# Altium project SMARTCAR.PRJPCB
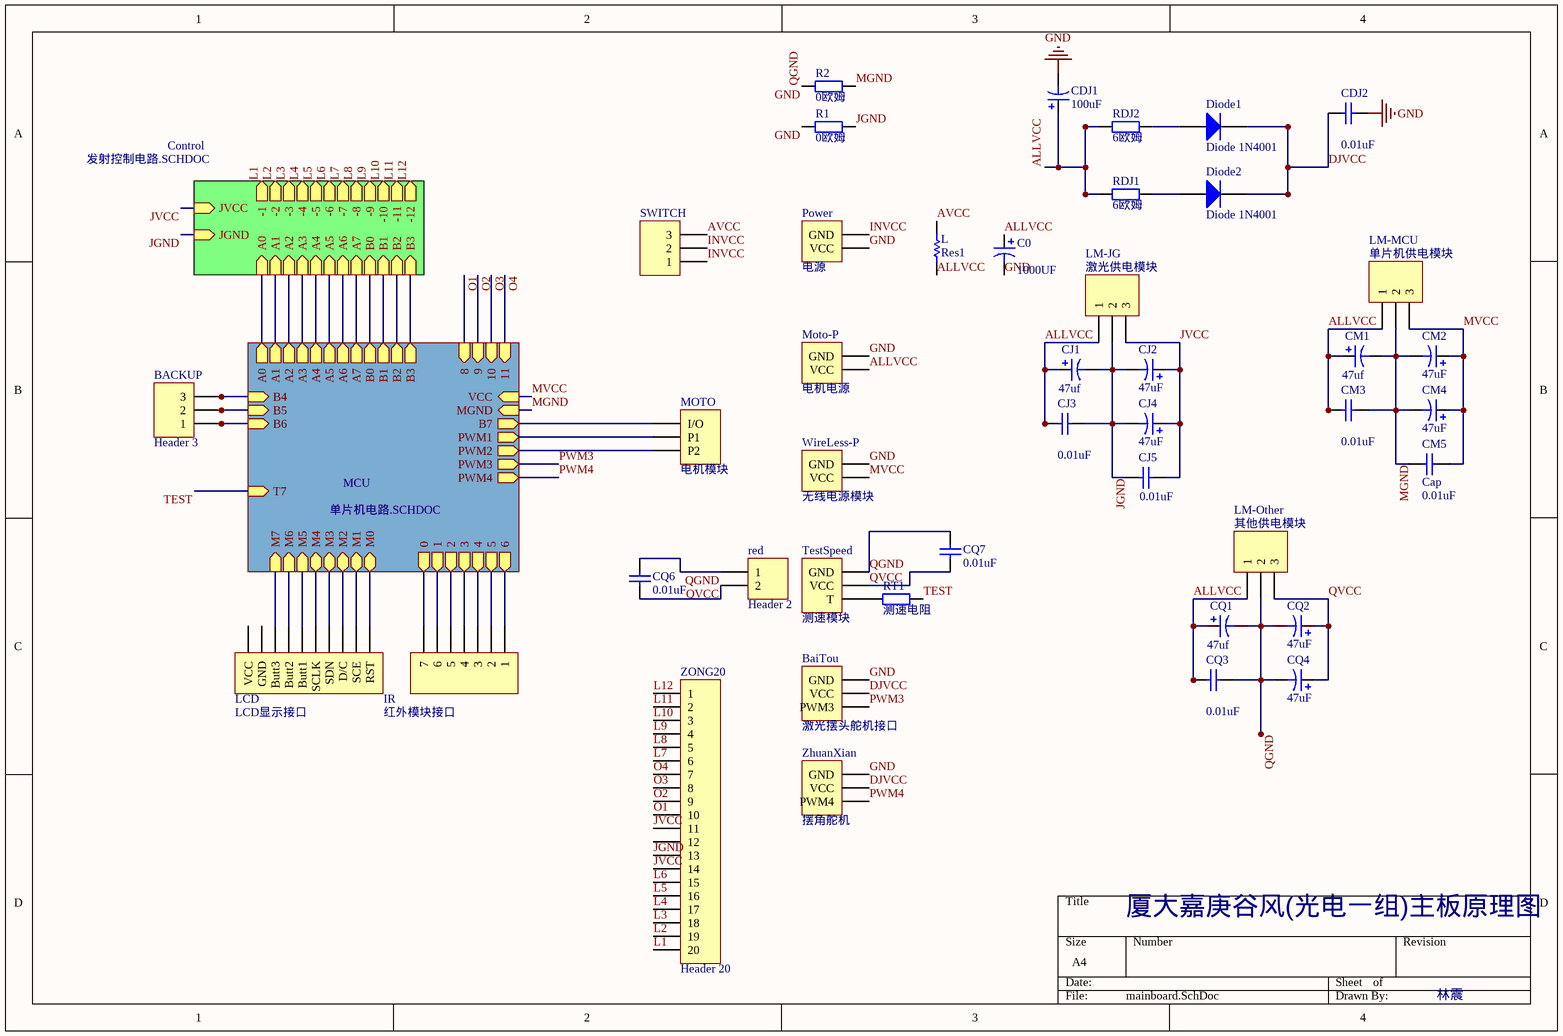
[diagram p0: mainboard.SchDoc]
2 sheets, 44 parts. Net scope: hierarchical (ports join the sheet entries above them; power ports are global).
Board file: mainboard.PCBDOC
Sheets:
  mainboard.SchDoc
    MCU = 单片机电路.SchDoc

## Sheet mainboard.SchDoc: 光电一队
size A4; Author: 林震; Organization: 厦门大学嘉庚学院

### Parts
BACKUP  Header 3  [HDR1X3]
BaiTou  激光摆头舵机接口  [HDR1X3]
C0  value 1000UF  [1000UF]  (hidden comment: BATT)
CDJ1  100uF  [100UF]
CDJ2  value 0.01uF  [0805]  (hidden comment: Cap)
CJ1  value 47uf  [3528]  (hidden comment: Cap Pol3)
CJ2  47uF  [3528]
CJ3  value 0.01uF  [0805]  (hidden comment: Cap)
CJ4  47uF  [47UF]
CJ5  value 0.01uF  [0805]  (hidden comment: Cap)
CM1  value 47uf  [3528]  (hidden comment: Cap Pol3)
CM2  47uF  [3528]
CM3  value 0.01uF  [0805]  (hidden comment: Cap)
CM4  47uF  [47UF]
CM5  Cap  value 0.01uF  [0805]
CQ1  value 47uf  [3528]  (hidden comment: Cap Pol3)
CQ2  47uF  [3528]
CQ3  value 0.01uF  [0805]  (hidden comment: Cap)
CQ4  47uF  [47UF]
CQ6  value 0.01uF  [0805]  (hidden comment: Cap)
CQ7  value 0.01uF  [0805]  (hidden comment: Cap)
Diode1  Diode 1N4001  [DO-41]
Diode2  Diode 1N4001  [DO-41]
IR  红外模块接口  [HDR1X7]
L  Res1  [10UH]
LCD  LCD显示接口  [HDR1X10]
LM-JG  激光供电模块  [HDR1X3]
LM-MCU  单片机供电模块  [HDR1X3]
LM-Other  其他供电模块  [HDR1X3]
MOTO  电机模块  [HDR1X3]
Moto-P  电机电源  [tongzhu]
Power  电源  [tongzhu]
R1  0欧姆  [0805]
R2  0欧姆  [0805]
RDJ1  6欧姆  [0805]
RDJ2  6欧姆  [0805]
red  Header 2  [HDR1X2]
RT1  测速电阻  [0805]
SWITCH  SWITCH  [SWITCH]  (value not drawn)
TestSpeed  测速模块  [HDR1X3]
WireLess-P  无线电源模块  [HDR1X2]
ZhuanXian  摆角舵机  [HDR1X3]
ZONG20  Header 20  [ZONG20]

### Sub-sheets
Control = 发射控制电路.SCHDOC (file not in this document): A0 (in), A1 (in), A2 (in), A3 (in), JVCC (in), JGND (in), A4 (in), A5 (in), A6 (in), A7 (in), B0 (in), B1 (in), B3 (in), B2 (in), -1 (out), -2 (out), -3 (out), -4 (out), -5 (out), -6 (out), -7 (out), -8 (out), -9 (out), -10 (out), -11 (out), -12 (out)
MCU = 单片机电路.SCHDOC: PWM1 (out), PWM2 (out), PWM3 (out), PWM4 (out), A1 (out), A2 (out), A3 (out), A4 (out), 8 (in), 9 (in), 10 (in), A0 (out), 11 (in), 1 (out), 2 (out), 3 (out), 4 (out), 5 (out), 6 (out), VCC (in), MGND (in), M4, M7 (in), M3, M2, M1, M0, M5 (in), M6 (in), 0 (out), A5 (out), A6 (out), B7 (out), B4 (in), B6 (in), B5 (in), T7 (in), A7 (out), B0 (out), B1 (out), B2 (out), B3 (out)

### Nets
GND: BaiTou.3(GND) C0.2 CDJ1.2 CDJ2.1 CQ1.2 CQ2.2 CQ3.1 CQ4.2 CQ6.1 CQ7.1 LM-Other.2 Moto-P.2(GND) Power.1(VCC) R1.2 R2.2 red.1 TestSpeed.3(GND) WireLess-P.2(GND) ZhuanXian.3(GND)  [also labelled QGND]
0: IR.7 ; sheet MCU/0
1: IR.6 ; sheet MCU/1
2: IR.5 ; sheet MCU/2
3: IR.4 ; sheet MCU/3
4: IR.3 ; sheet MCU/4
5: IR.2 ; sheet MCU/5
6: IR.1 ; sheet MCU/6
A0: sheet Control/A0, sheet MCU/A0
A1: sheet Control/A1, sheet MCU/A1
A2: sheet Control/A2, sheet MCU/A2
A3: sheet Control/A3, sheet MCU/A3
A4: sheet Control/A4, sheet MCU/A4
A5: sheet Control/A5, sheet MCU/A5
ALLVCC: C0.1 CDJ1.1 CJ1.1 CJ3.2 CM1.1 CM3.2 CQ1.1 CQ3.2 L.1 LM-JG.1 LM-MCU.1 LM-Other.1 Moto-P.1(VCC) RDJ1.2 RDJ2.2
AVCC: L.2 SWITCH.3
B0: sheet Control/B0, sheet MCU/B0
B1: sheet Control/B1, sheet MCU/B1
B2: sheet Control/B2, sheet MCU/B2
B3: sheet Control/B3, sheet MCU/B3
B4: BACKUP.3 ; sheet MCU/B4
B5: BACKUP.2 ; sheet MCU/B5
B6: BACKUP.1 ; sheet MCU/B6
B7: MOTO.1(I/O) ; sheet MCU/B7
DJVCC: BaiTou.2(VCC) CDJ2.2 Diode1.2(K) Diode2.2(K) ZhuanXian.2(VCC)
INVCC: Power.2(GND) SWITCH.1 SWITCH.2
JGND: CJ1.2 CJ2.2 CJ3.1 CJ4.2 CJ5.2 LM-JG.2 R1.1 ZONG20.13 ; sheet Control/JGND
JVCC: CJ2.1 CJ4.1 CJ5.1 LM-JG.3 ZONG20.11 ZONG20.14 ; sheet Control/JVCC
L1: ZONG20.20 ; sheet Control/-1
L2: ZONG20.19 ; sheet Control/-2
L3: ZONG20.18 ; sheet Control/-3
L4: ZONG20.17 ; sheet Control/-4
L5: ZONG20.16 ; sheet Control/-5
L6: ZONG20.15 ; sheet Control/-6
L7: ZONG20.6 ; sheet Control/-7
L8: ZONG20.5 ; sheet Control/-8
L9: ZONG20.4 ; sheet Control/-9
L10: ZONG20.3 ; sheet Control/-10
L11: ZONG20.2 ; sheet Control/-11
L12: ZONG20.1 ; sheet Control/-12
M0: LCD.1(RST) ; sheet MCU/M0
M1: LCD.2(SCE) ; sheet MCU/M1
M2: LCD.3(D/C) ; sheet MCU/M2
M3: LCD.4(SDN) ; sheet MCU/M3
M4: LCD.5(SCLK) ; sheet MCU/M4
M5: LCD.6(Butt1) ; sheet MCU/M5
M6: LCD.7(Butt2) ; sheet MCU/M6
M7: LCD.8(Butt3) ; sheet MCU/M7
MGND: CM1.2 CM2.2 CM3.1 CM4.2 CM5.2 LM-MCU.2 R2.1 ; sheet MCU/MGND
MVCC: CM2.1 CM4.1 CM5.1 LM-MCU.3 WireLess-P.1(VCC) ; sheet MCU/VCC
O1: ZONG20.10 ; sheet MCU/8
O2: ZONG20.9 ; sheet MCU/9
O3: ZONG20.8 ; sheet MCU/10
O4: ZONG20.7 ; sheet MCU/11
PWM1: MOTO.2(P1) ; sheet MCU/PWM1
PWM2: MOTO.3(P2) ; sheet MCU/PWM2
PWM3: BaiTou.1(PWM3) ; sheet MCU/PWM3
PWM4: ZhuanXian.1(PWM4) ; sheet MCU/PWM4
QVCC: CQ2.1 CQ4.1 CQ6.2 CQ7.2 LM-Other.3 red.2 TestSpeed.2(VCC)
TEST: RT1.2 ; sheet MCU/T7  [project net T7]
NetDiode1_1: Diode1.1(A) RDJ2.1
NetDiode2_1: Diode2.1(A) RDJ1.1
NetRT1_1: RT1.1 TestSpeed.1(T)
(unnamed): sheet Control/A6, sheet MCU/A6
(unnamed): sheet Control/A7, sheet MCU/A7

Not connected (* = marked no-connect by the designer): LCD 9(GND) 10(VCC); ZONG20 12

### Notes on the sheet
- 厦大嘉庚谷风(光电一组)主板原理图
- 林震

### Library data of the parts
BACKUP = Header 3: 备用; LatestRevisionDate: 17-Jul-2002; LatestRevisionNote: Re-released for DXP Platform.; Publisher: Altium Limited
BaiTou LM-JG LM-MCU LM-Other MOTO SWITCH TestSpeed ZhuanXian = Header 3: Header, 3-Pin; LatestRevisionDate: 17-Jul-2002; LatestRevisionNote: Re-released for DXP Platform.; Publisher: Altium Limited
C0 CJ1 CM1 CQ1 = Cap Pol3: Polarized Capacitor (Surface Mount); Published: 8-Jun-2000; LatestRevisionDate: 17-Jul-2002; LatestRevisionNote: Re-released for DXP Platform.; PackageReference: C0805; Publisher: Altium Limited
CDJ1 CJ2 CJ4 CM2 CM4 CQ2 CQ4 = Cap Pol1: Polarized Capacitor (Radial); Published: 8-Jun-2000; LatestRevisionDate: 17-Jul-2002; LatestRevisionNote: Re-released for DXP Platform.; Publisher: Altium Limited
CDJ2 CJ3 CJ5 CM3 CM5 CQ3 CQ6 CQ7 = Cap: Capacitor; Published: 8-Jun-2000; LatestRevisionDate: 17-Jul-2002; LatestRevisionNote: Re-released for DXP Platform.; PackageReference: RAD-0.3; Publisher: Altium Limited
Diode1 Diode2 = Diode 1N4001: 1 Amp General Purpose Rectifier; Published: 8-Jun-2000; LatestRevisionDate: 17-Jul-2002; LatestRevisionNote: Re-released for DXP Platform.; DatasheetDocument: 1998; PackageDocument: Aug-1999; PackageReference: DO-41; Publisher: Altium Limited; Code_JEDEC: DO-204-AL; ComponentLink1Description: Manufacturer Link; ComponentLink1URL: http://www.fairchildsemi.com/; ComponentLink2Description: Datasheet; ComponentLink2URL: http://www.fairchildsemi.com/ds/1N%2F1N4001.pdf
IR = Header 7: Header, 7-Pin; LatestRevisionDate: 17-Jul-2002; LatestRevisionNote: Re-released for DXP Platform.; Publisher: Altium Limited
L = Res1: Resistor; Value: 1K; Published: 8-Jun-2000; LatestRevisionDate: 17-Jul-2002; LatestRevisionNote: Re-released for DXP Platform.; PackageReference: AXIAL-0.3; Publisher: Altium Limited
LCD = Header 10: Header, 10-Pin; LatestRevisionDate: 17-Jul-2002; LatestRevisionNote: Re-released for DXP Platform.; Publisher: Altium Limited
Moto-P Power red WireLess-P = Header 2: Header, 2-Pin; LatestRevisionDate: 17-Jul-2002; LatestRevisionNote: Re-released for DXP Platform.; Publisher: Altium Limited
R1 R2 RDJ1 RDJ2 RT1 = Res2: Resistor; Published: 8-Jun-2000; LatestRevisionDate: 17-Jul-2002; LatestRevisionNote: Re-released for DXP Platform.; Publisher: Altium Limited
ZONG20 = Header 20: 传感下来引脚; LatestRevisionDate: 17-Jul-2002; LatestRevisionNote: Re-released for DXP Platform.; Publisher: Altium Limited

## Sheet 单片机电路.SchDoc
size A4
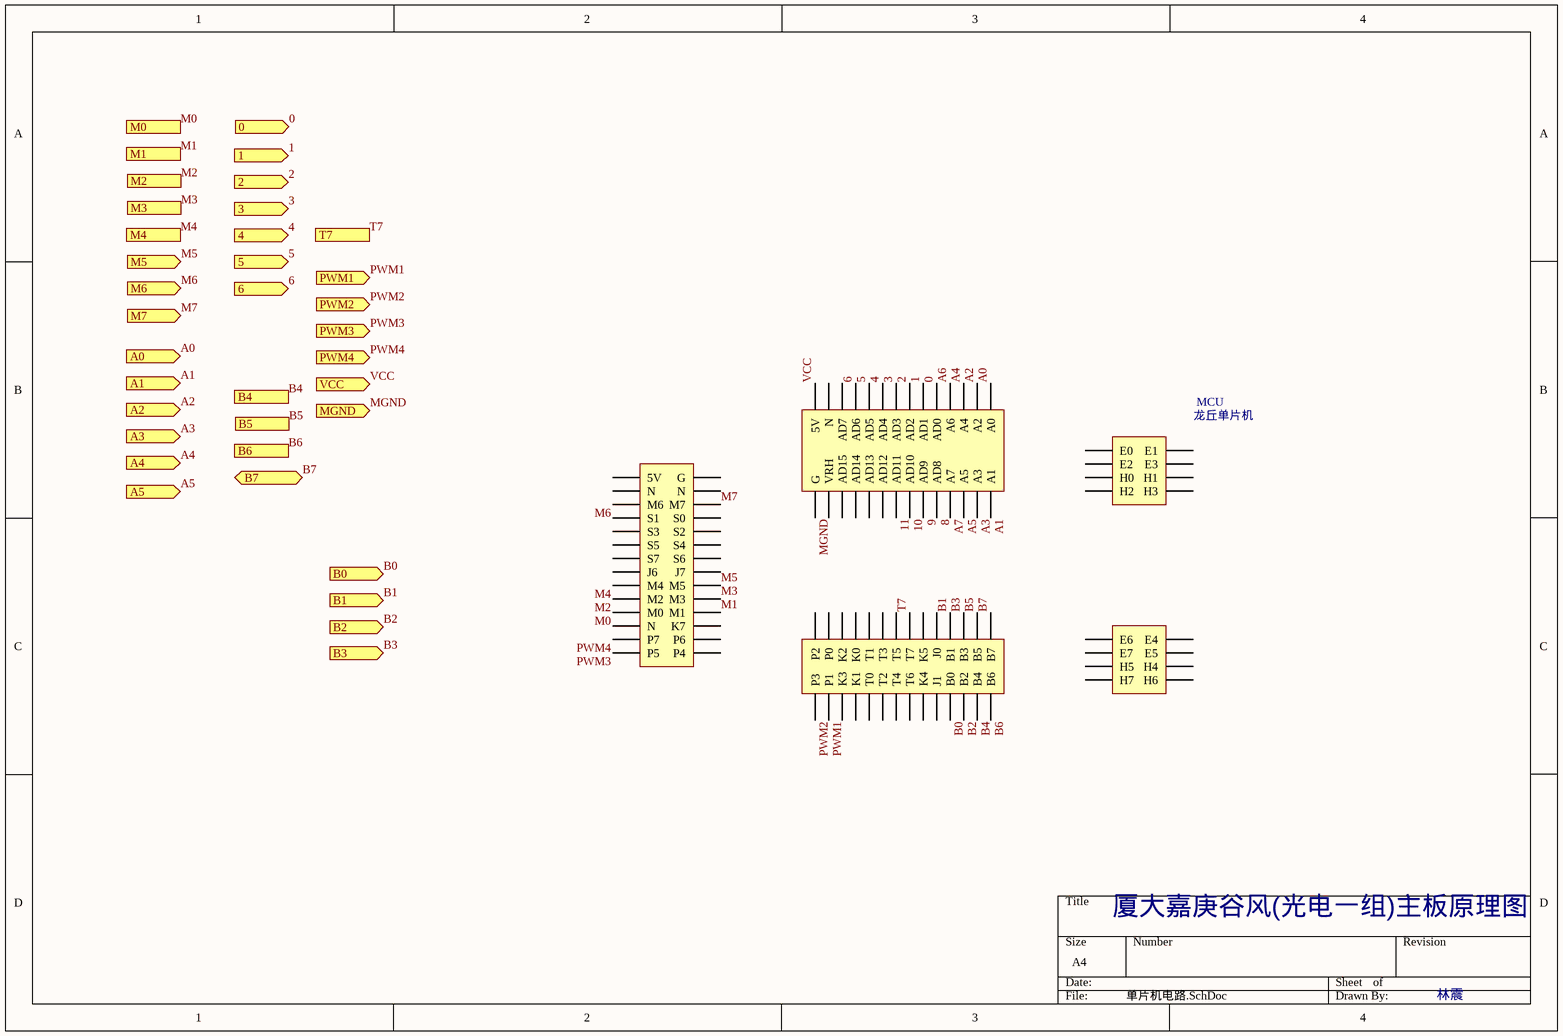
[diagram p1: 单片机电路.SchDoc]

### Parts
MCU  龙丘单片机  [LQ_112_BOARD]

### Ports
0 (out), 1 (out), 2 (out), 3 (out), 4 (out), 5 (out), 6 (out), A0 (out), A1 (out), A2 (out), A3 (out), A4 (out), A5 (out), B0 (in), B1 (in), B2 (in), B3 (in), B4 (in), B5 (in), B6 (in), B7 (out), M0, M1, M2, M3, M4, M5 (in), M6 (in), M7 (in), MGND (in), PWM1 (out), PWM2 (out), PWM3 (out), PWM4 (out), T7, VCC (in)

### Nets
0: MCU.309(AD0) ; port 0
1: MCU.311(AD1) ; port 1
2: MCU.313(AD2) ; port 2
3: MCU.315(AD3) ; port 3
4: MCU.317(AD4) ; port 4
5: MCU.319(AD5) ; port 5
6: MCU.321(AD6) ; port 6
8: MCU.310(AD8)
9: MCU.312(AD9)
10: MCU.314(AD10)
11: MCU.316(AD11)
A0: MCU.301(A0) ; port A0
A1: MCU.302(A1) ; port A1
A2: MCU.303(A2) ; port A2
A3: MCU.304(A3) ; port A3
A4: MCU.305(A4) ; port A4
A5: MCU.306(A5) ; port A5
A6: MCU.307(A6)
A7: MCU.308(A7)
B0: MCU.121(B0) ; port B0
B1: MCU.122(B1) ; port B1
B2: MCU.123(B2) ; port B2
B3: MCU.124(B3) ; port B3
B4: MCU.125(B4) ; port B4
B5: MCU.126(B5) ; port B5
B6: MCU.127(B6) ; port B6
B7: MCU.128(B7) ; port B7
M0: MCU.221(M0) ; port M0
M1: MCU.222(M1) ; port M1
M2: MCU.219(M2) ; port M2
M3: MCU.220(M3) ; port M3
M4: MCU.217(M4) ; port M4
M5: MCU.218(M5) ; port M5
M6: MCU.205(M6) ; port M6
M7: MCU.206(M7) ; port M7
MGND: MCU.328(G) ; port MGND
PWM1: MCU.103(P1) ; port PWM1
PWM2: MCU.101(P3) ; port PWM2
PWM3: MCU.227(P5) ; port PWM3
PWM4: MCU.225(P7) ; port PWM4
T7: MCU.116(T7) ; port T7
VCC: MCU.327(5V) ; port VCC  [project net MVCC]

Not connected (* = marked no-connect by the designer): MCU 102(P2) 104(P0) 105(K3) 106(K2) 107(K1) 108(K0) 109(T0) 110(T1) 111(T2) 112(T3) 113(T4) 114(T5) 115(T6) 117(K4) 118(K5) 119(J1) 120(J0) 201(5V) 202(G) 203(N) 204(N) 207(S1) 208(S0) 209(S3) 210(S2) 211(S5) 212(S4) 213(S7) 214(S6) 215(J6) 216(J7) 223(N) 224(K7) 226(P6) 228(P4) 318(AD12) 320(AD13) 322(AD14) 323(AD7) 324(AD15) 325(N) 326(VRH) 401(H6) 402(H7) 403(H4) 404(H5) 405(E5) 406(E7) 407(E4) 408(E6) 501(H3) 502(H2) 503(H1) 504(H0) 505(E3) 506(E2) 507(E1) 508(E0)

### Notes on the sheet
- 厦大嘉庚谷风(光电一组)主板原理图
- 林震

### Library data of the parts
MCU = LQ_112_BOARD

## Nets that join several sheets
0: mainboard (IR.7), 单片机电路 (MCU.309)
1: mainboard (IR.6), 单片机电路 (MCU.311)
2: mainboard (IR.5), 单片机电路 (MCU.313)
3: mainboard (IR.4), 单片机电路 (MCU.315)
4: mainboard (IR.3), 单片机电路 (MCU.317)
5: mainboard (IR.2), 单片机电路 (MCU.319)
6: mainboard (IR.1), 单片机电路 (MCU.321)
B4: mainboard (BACKUP.3), 单片机电路 (MCU.125)
B5: mainboard (BACKUP.2), 单片机电路 (MCU.126)
B6: mainboard (BACKUP.1), 单片机电路 (MCU.127)
B7: mainboard (MOTO.1), 单片机电路 (MCU.128)
M0: mainboard (LCD.1), 单片机电路 (MCU.221)
M1: mainboard (LCD.2), 单片机电路 (MCU.222)
M2: mainboard (LCD.3), 单片机电路 (MCU.219)
M3: mainboard (LCD.4), 单片机电路 (MCU.220)
M4: mainboard (LCD.5), 单片机电路 (MCU.217)
M5: mainboard (LCD.6), 单片机电路 (MCU.218)
M6: mainboard (LCD.7), 单片机电路 (MCU.205)
M7: mainboard (LCD.8), 单片机电路 (MCU.206)
MGND: mainboard (7 pins), 单片机电路 (MCU.328)
MVCC: mainboard (5 pins), 单片机电路 (MCU.327)
PWM1: mainboard (MOTO.2), 单片机电路 (MCU.103)
PWM2: mainboard (MOTO.3), 单片机电路 (MCU.101)
PWM3: mainboard (BaiTou.1), 单片机电路 (MCU.227)
PWM4: mainboard (ZhuanXian.1), 单片机电路 (MCU.225)
T7: mainboard (RT1.2), 单片机电路 (MCU.116)